# EAGLE schematic ELEKTRA-BENCH v0.1-20240103 (EAGLE 9.6.2)
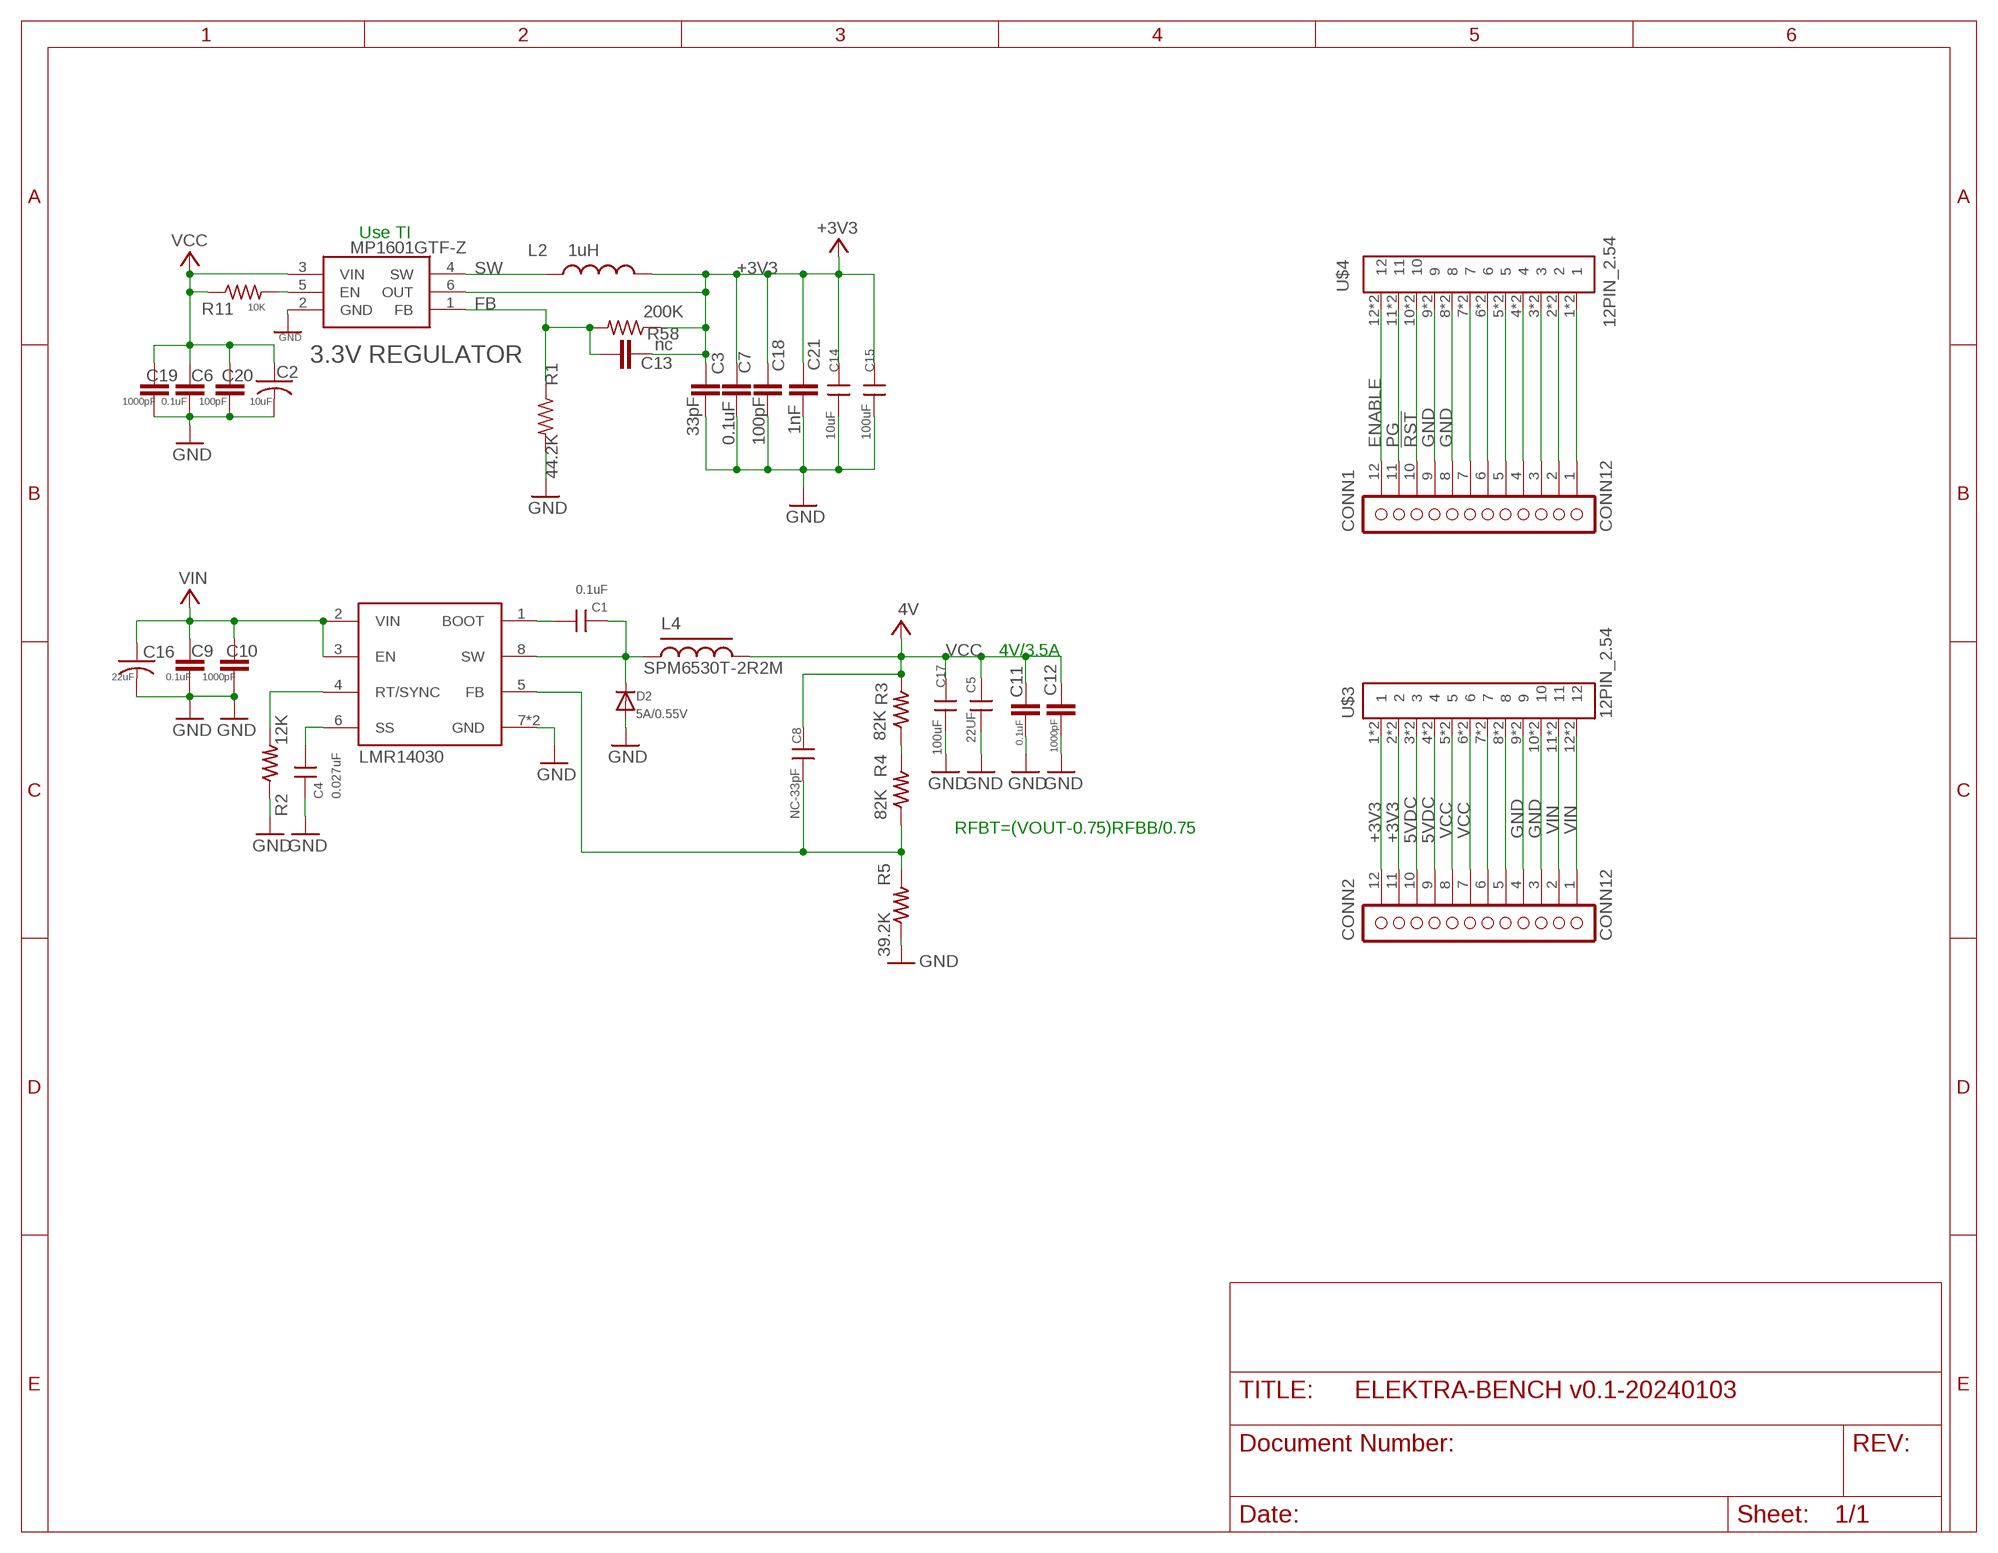
[diagram p0: schematic, sheet 1]

## Parts
C1  0.1uF  CAP0402A  [C0402]
C2  10uF  C-US0603  [C0603_B]
C3  33pF  CAP_1  [C0402_B]
C4  0.027uF  CAP0402A  [C0402]
C5  22UF  CAPC0805  [C0805]
C6  0.1uF  CAP_1  [C0402_B]
C7  0.1uF  CAP_1  [C0402_B]
C8  NC-33pF  CAP0402A  [C0402]
C9  0.1uF  CAP_1  [C0402_B]
C10  1000pF  CAP_1  [C0402_B]
C11  0.1uF  CAP_1  [C0402_B]
C12  1000pF  CAP_1  [C0402_B]
C13  nc  CAP_1  [C0402_B]
C14  10uF  CAPC0805  [C0805]
C15  100uF  CAPC1206  [C1206]
C16  22uF  C-US0603  [C0603_B]
C17  100uF  CAPC1206  [C1206]
C18  100pF  CAP_1  [C0402_B]
C19  1000pF  CAP_1  [C0402_B]
C20  100pF  CAP_1  [C0402_B]
C21  1nF  CAP_1  [C0402_B]
CONN1  CONN12  [1X12_SMD_STRAIGHT]
CONN2  CONN12  [1X12_SMD_STRAIGHT]
D2  5A/0.55V  DIODESMA  [SMADIODE]
L2  1uH  INDUCTOR-SPARKFUNVLS3012ET-4R7M  [INDUCTOR-VLS-E]
L4  SPM6530T-2R2M  INDUCTOR  [INDCUTOR_SPM6530]
R1  44.2K  R-US_  [R0402_B]
R2  12K  RES0402S  [R-0402S]
R3  82K  RES0402S  [R-0402S]
R4  82K  RES0402S  [R-0402S]
R5  39.2K  RES0402S  [R-0402S]
R11  10K  R-US_  [R0402_B]
R58  200K  R-US_  [R0402_B]
U2  LMR14030  [SO_POWERPAD_8]
U3  MP1601GTF-Z  [SOTFL50P160X60-6N]
U$3  12PIN_2.54  [12PIN_2.54]
U$4  12PIN_2.54  [12PIN_2.54]

## Nets
5VDC: CONN2.9 CONN2.10 U$3.3 U$3.4 U$3.P$3 U$3.P$4
!RST: CONN1.10 U$4.10 U$4.P$10
+3V3: C3.2 C7.2 C13.1 C14.1 C15.1 C18.2 C21.2 CONN2.11 CONN2.12 L2.P$2 R58.1 U3.6(OUT) U$3.1 U$3.2 U$3.P$1 U$3.P$2
ENABLE: CONN1.12 U$4.12 U$4.P$12
FB: C13.2 R1.1 R58.2 U3.1(FB)
GND: C2.2 C3.1 C4.2 C5.2 C6.1 C7.1 C9.1 C10.1 C11.1 C12.1 C14.2 C15.2 C16.2 C17.2 C18.1 C19.1 C20.1 C21.1 CONN1.8 CONN1.9 CONN2.3 CONN2.4 D2.A R1.2 R2.1 R5.1 U2.7(GND) U2.EP(GND) U3.2(GND) U$3.9 U$3.10 U$3.P$9 U$3.P$10 U$4.8 U$4.9 U$4.P$8 U$4.P$9
N$2: C8.1 R4.1 R5.2 U2.5(FB)
N$3: CONN1.7 U$4.7 U$4.P$7
N$4: CONN1.6 U$4.6 U$4.P$6
N$5: CONN1.5 U$4.5 U$4.P$5
N$6: CONN1.4 U$4.4 U$4.P$4
N$7: R11.2 U3.5(EN)
N$8: C4.1 U2.6(SS)
N$9: C1.2 D2.C L4.1 U2.8(SW)
N$10: C1.1 U2.1(BOOT)
N$11: R2.2 U2.4(RT/SYNC)
N$12: R3.1 R4.2
N$13: CONN1.3 U$4.3 U$4.P$3
N$14: CONN1.2 U$4.2 U$4.P$2
N$15: CONN1.1 U$4.1 U$4.P$1
N$20: CONN2.6 U$3.7 U$3.P$7
N$21: CONN2.5 U$3.8 U$3.P$8
PG: CONN1.11 U$4.11 U$4.P$11
SW: L2.P$1 U3.4(SW)
VCC: C2.1 C5.1 C6.2 C8.2 C11.2 C12.2 C17.1 C19.2 C20.2 CONN2.7 CONN2.8 L4.2 R3.2 R11.1 U3.3(VIN) U$3.5 U$3.6 U$3.P$5 U$3.P$6 ; supply symbol labelled 4V
VIN: C9.2 C10.2 C16.1 CONN2.1 CONN2.2 U2.2(VIN) U2.3(EN) U$3.11 U$3.12 U$3.P$11 U$3.P$12

## Notes on the sheet
- Use TI
- 3.3V REGULATOR
- 4V/3.5A
- RFBT=(VOUT-0.75)RFBB/0.75

## Library data of the parts
C1 C4 C5 C8 C14 C15 C17 = particle SZ:CAP: CAP
C2 C16 = Bretts-Spark-Library:C-US: Capacitor
C3 C6 C7 C9-C13 C18-C21 = Particle:CAP_1
CONN1 CONN2 = particle-studios:CONN12
D2 = particle-studios:DIODE: Diode SMADIODE - SMA Surface Mount Package 20V 1A Schottky Diode Digikey: 641-1014-6-ND DO-1N4148 - Through Hole Small Current Diode SOD-123 20V 1 A (.5mV Vf) Schottky Diode - Digikey: MBRX120TPMSCT-ND SOD-323 10V 570mA (.38mV Vf, 3ns) Schottky Diode - Digikey: ZLLS410CT-ND SOD-523 30V 30mA Schottky Diode (RB751S-40TE61) - Digikey: RB751S-40TE61CT-ND SOT23-R/W - SOT23 Package (R = Solder Paste/Reflow Ovens, W = Hand-Soldering) BAT54Film 40V 300mA - Digikey: 497-7162-1-ND
L2 = Particle:INDUCTOR-SPARKFUN: Inductors Basic Inductor/Choke - 0603 and 1206. Footprints are not proven and vary greatly between part numbers. SRN6045- 33uH, 20% 1.4A
L4 = particle-studios:INDUCTOR
R1 R58 = Particle:R-US_: 0402 Resistor
R2-R5 = particle SZ:RES: RES
R11 = Spark:R-US_: 0402 Resistor
U2 = particle-studios:LMR14030
U3 = MP1601GTF-Z:MP1601GTF-Z: Conv DC-DC Single Step Down 2.3V to 5.5V 6-Pin SOT-563 T/R - Tape and Reel Source: Datasheet <https://www.monolithicpower.com/en/documentview/productdocument/index/version/2/document_type/Datasheet/lang/en/sku/MP1601/document_id/1038/>; DESCRIPTION: Conv DC-DC Single Step Down 2.3V to 5.5V 6-Pin SOT-563 T/R - Tape and Reel; HEIGHT: 0.6mm; MANUFACTURER_NAME: Monolithic Power Systems (MPS); MANUFACTURER_PART_NUMBER: MP1601GTF-Z
U$3 U$4 = particle SZ:12PIN_2.54

## Net classes
0 default: width 0.152 mm, clearance 0.152 mm
1 power: width 0.254 mm, drill 0.61 mm, clearance 0.203 mm
3 BAT: clearance 0.203 mm
4 3V3: width 0.305 mm, clearance 0.508 mm
6 +3V3: width 0.203 mm, clearance 0.152 mm